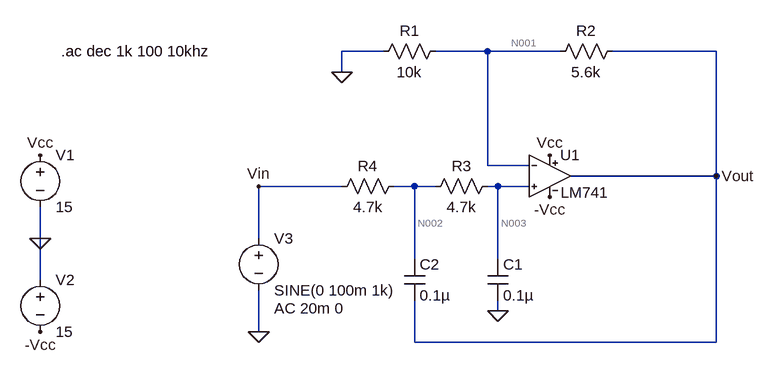
[diagram p0: schematic LowPassFilter.asc]
LowPassFilter.asc, the LTspice schematic file:
Version 4
SHEET 1 1512 680
WIRE 608 -80 544 -80
WIRE 768 -80 688 -80
WIRE 880 -80 768 -80
WIRE 1120 -80 960 -80
WIRE 544 -48 544 -80
WIRE 768 96 768 -80
WIRE 832 96 768 96
WIRE 1120 112 1120 -80
WIRE 1120 112 896 112
WIRE 544 128 416 128
WIRE 656 128 624 128
WIRE 688 128 656 128
WIRE 784 128 768 128
WIRE 832 128 784 128
WIRE 80 208 80 160
WIRE 416 208 416 128
WIRE 656 240 656 128
WIRE 784 240 784 128
WIRE 80 272 80 208
WIRE 784 320 784 304
WIRE 416 352 416 288
WIRE 656 368 656 304
WIRE 1120 368 1120 112
WIRE 1120 368 656 368
FLAG 80 208 0
FLAG 80 80 Vcc
FLAG 80 352 -Vcc
FLAG 416 352 0
FLAG 864 80 Vcc
FLAG 864 144 -Vcc
FLAG 784 320 0
FLAG 544 -48 0
FLAG 1120 112 Vout
FLAG 416 128 Vin
SYMBOL voltage 80 64 R0
WINDOW 123 0 0 Left 0
WINDOW 39 0 0 Left 0
SYMATTR InstName V1
SYMATTR Value 15
SYMBOL voltage 80 256 R0
WINDOW 123 0 0 Left 0
WINDOW 39 0 0 Left 0
SYMATTR InstName V2
SYMATTR Value 15
SYMBOL voltage 416 192 R0
WINDOW 123 24 124 Left 2
WINDOW 39 0 0 Left 0
SYMATTR Value2 AC 20m 0
SYMATTR InstName V3
SYMATTR Value SINE(0 100m 1k)
SYMBOL res 640 112 R90
WINDOW 0 0 56 VBottom 2
WINDOW 3 32 56 VTop 2
SYMATTR InstName R4
SYMATTR Value 4.7k
SYMBOL res 784 112 R90
WINDOW 0 0 56 VBottom 2
WINDOW 3 32 56 VTop 2
SYMATTR InstName R3
SYMATTR Value 4.7k
SYMBOL LM741 864 48 R0
SYMATTR InstName U1
SYMBOL cap 640 240 R0
SYMATTR InstName C2
SYMATTR Value 0.1µ
SYMBOL cap 768 240 R0
SYMATTR InstName C1
SYMATTR Value 0.1µ
SYMBOL res 976 -96 R90
WINDOW 0 0 56 VBottom 2
WINDOW 3 32 56 VTop 2
SYMATTR InstName R2
SYMATTR Value 5.6k
SYMBOL res 704 -96 R90
WINDOW 0 0 56 VBottom 2
WINDOW 3 32 56 VTop 2
SYMATTR InstName R1
SYMATTR Value 10k
TEXT 112 -80 Left 2 !.ac dec 1k 100 10khz

The netlist it stands for:
* LowPassFilter.asc
V1 Vcc 0 15
V2 0 -Vcc 15
V3 Vin 0 SINE(0 100m 1k) AC 20m 0
R4 N002 Vin 4.7k
R3 N003 N002 4.7k
XU1 N003 N001 Vcc -Vcc Vout LM741  ; pins In+ In- V+ V- OUT
C2 N002 Vout 0.1µ
C1 N003 0 0.1µ
R2 Vout N001 5.6k
R1 N001 0 10k
.ac dec 1k 100 10khz
.lib LM741.lib
.backanno
.end

* Results of the author's LTspice run, read from the files saved beside the schematic
* Operating Point, zero values left out:
*   V(vcc) = 15 V
*   V(-vcc) = -15 V
*   V(n002) = -271.9 µV
*   V(n003) = -543.9 µV
*   V(n001) = 456.1 µV
*   V(vout) = 1.282 mV
*   I(R1) = 45.61 nA
*   I(R2) = 147.5 nA
*   I(R3) = -57.86 nA
*   I(R4) = -57.86 nA
*   I(V3) = -57.86 nA
*   I(V2) = -1.701 mA
*   I(V1) = -1.701 mA
*   Ix(u1:1) = 57.86 nA
*   Ix(u1:2) = 101.9 nA
*   Ix(u1:99) = 1.701 mA
*   Ix(u1:50) = -1.701 mA
*   Ix(u1:28) = -147.5 nA
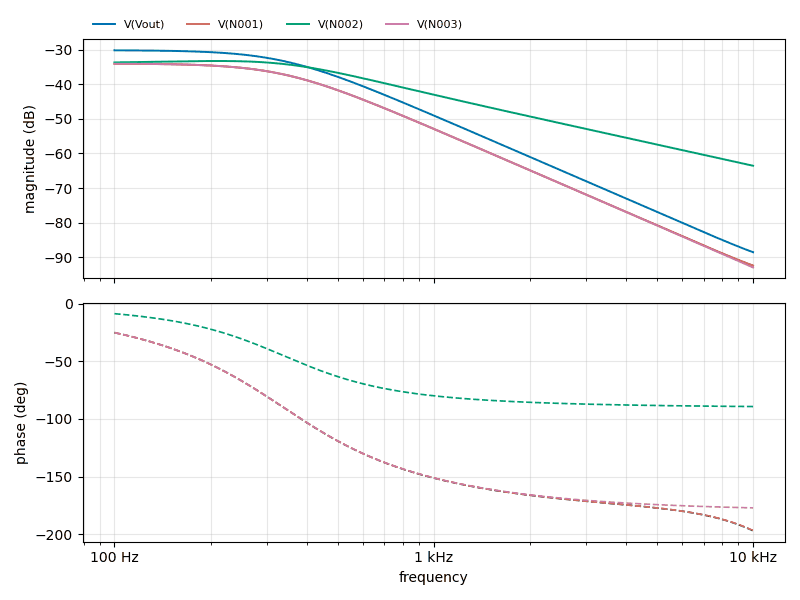
[diagram p1: AC Analysis of LowPassFilter.asc, plotted from the saved traces]
* AC Analysis, 1 run:
*   V(Vout): -30.18 dB at 100 Hz, -88.54 dB at 10 kHz, peak -30.18 dB at 100 Hz, 3 dB below the peak at 334.8 Hz
*   V(N001): -34.04 dB at 100 Hz, -92.41 dB at 10 kHz, peak -34.04 dB at 100 Hz, 3 dB below the peak at 334.8 Hz
*   V(N002): -33.68 dB at 100 Hz, -63.55 dB at 10 kHz, peak -33.27 dB at 210.9 Hz, 3 dB below the peak at 476.1 Hz
*   V(N003): -34.04 dB at 100 Hz, -92.96 dB at 10 kHz, peak -34.04 dB at 100 Hz, 3 dB below the peak at 334.8 Hz